# EasyEDA Pro project Design A.eprj

# Schematic Schematic1
Board Name: Board1; Create Date: 2026-05-07; Page Name: P1; Project Name: Design A; Schematic Name: Schematic1; Update Date: 2026-05-07; Company: EasyEDA.com; Page Size: A4; Version: V1.0
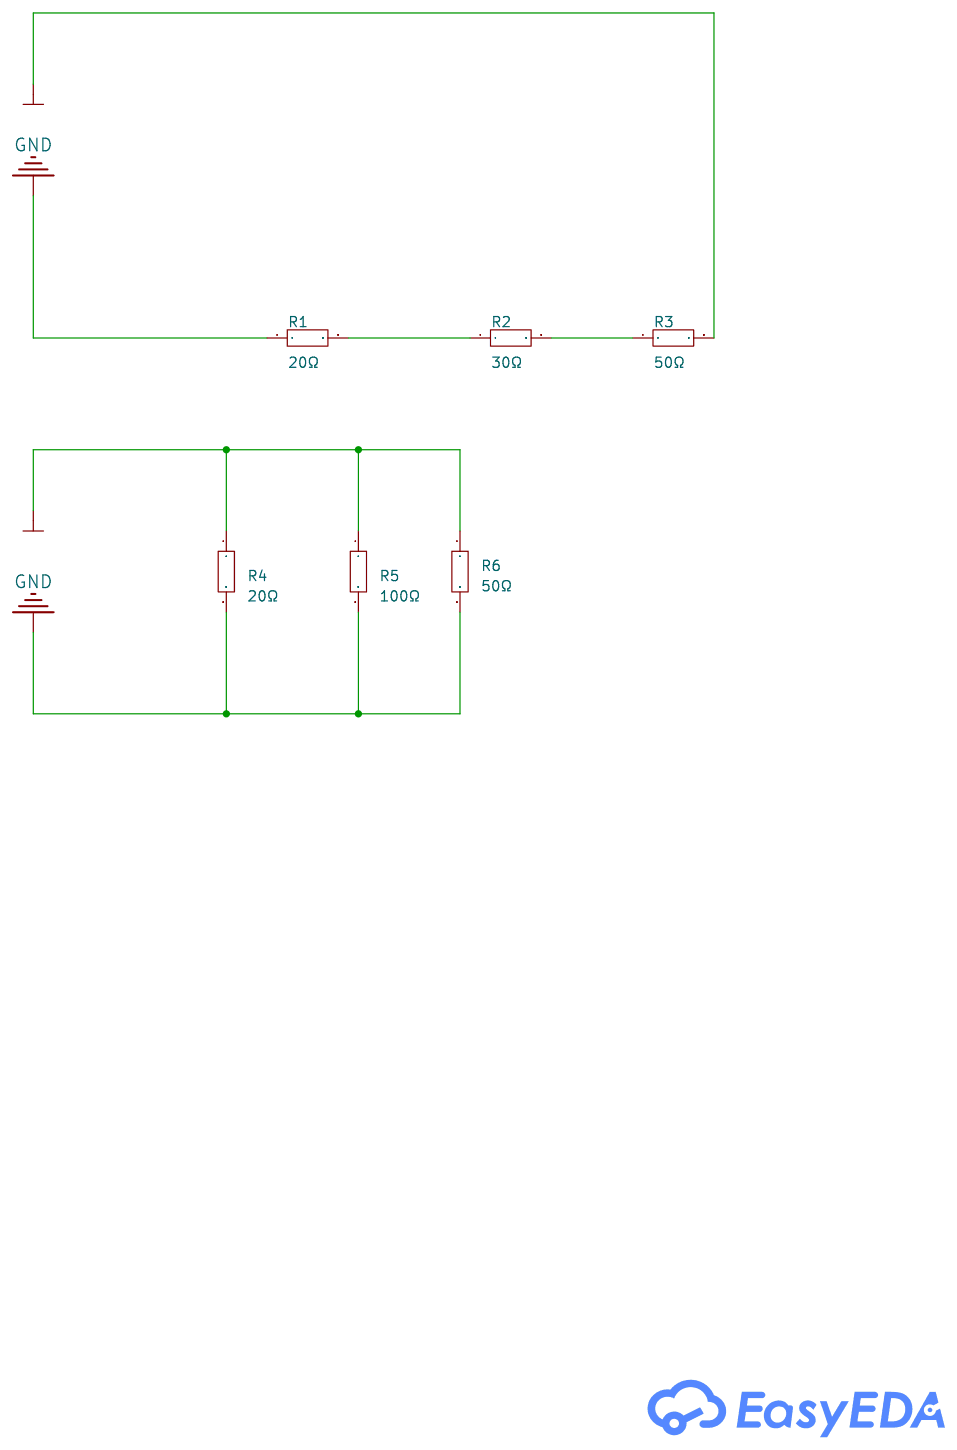
[diagram p0: schematic sheet]

## Parts
R1  20Ω  [R0603]
R2  30Ω  [R0603]
R3  50Ω  [R0603]
R4  20Ω  [R0603]
R5  100Ω  [R0603]
R6  50Ω  [R0603]

## Library data of the parts
R1-R6 = Res_0603: Supplier Footprint: 0603

## Nets
+125V: R3.2 R4.1 R5.1 R6.1
GND: R1.1 R4.2 R5.2 R6.2
Net-(R1-2): R1.2 R2.1
Net-(R2-2): R2.2 R3.1
